# EAGLE schematic fretscanner5000 (EAGLE 6.6.0)
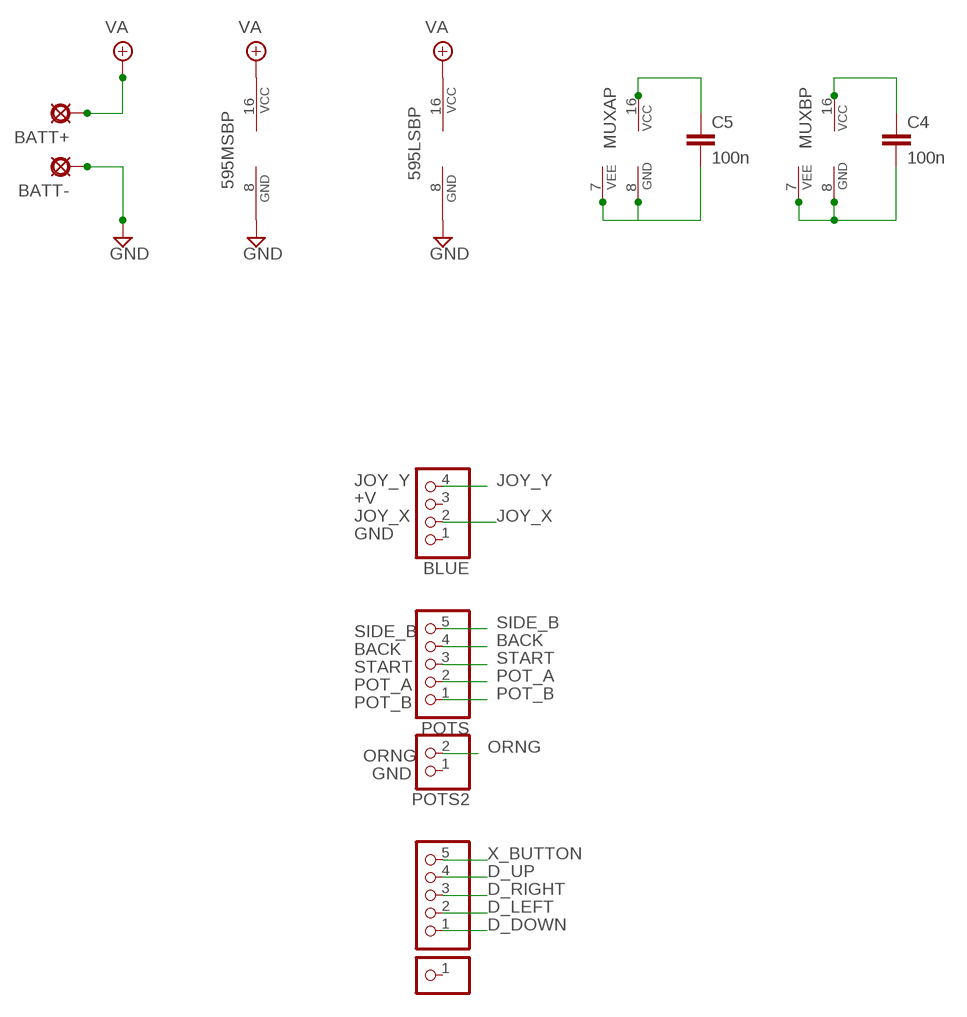
[diagram p0: schematic, sheet 1, part 1 of 2]
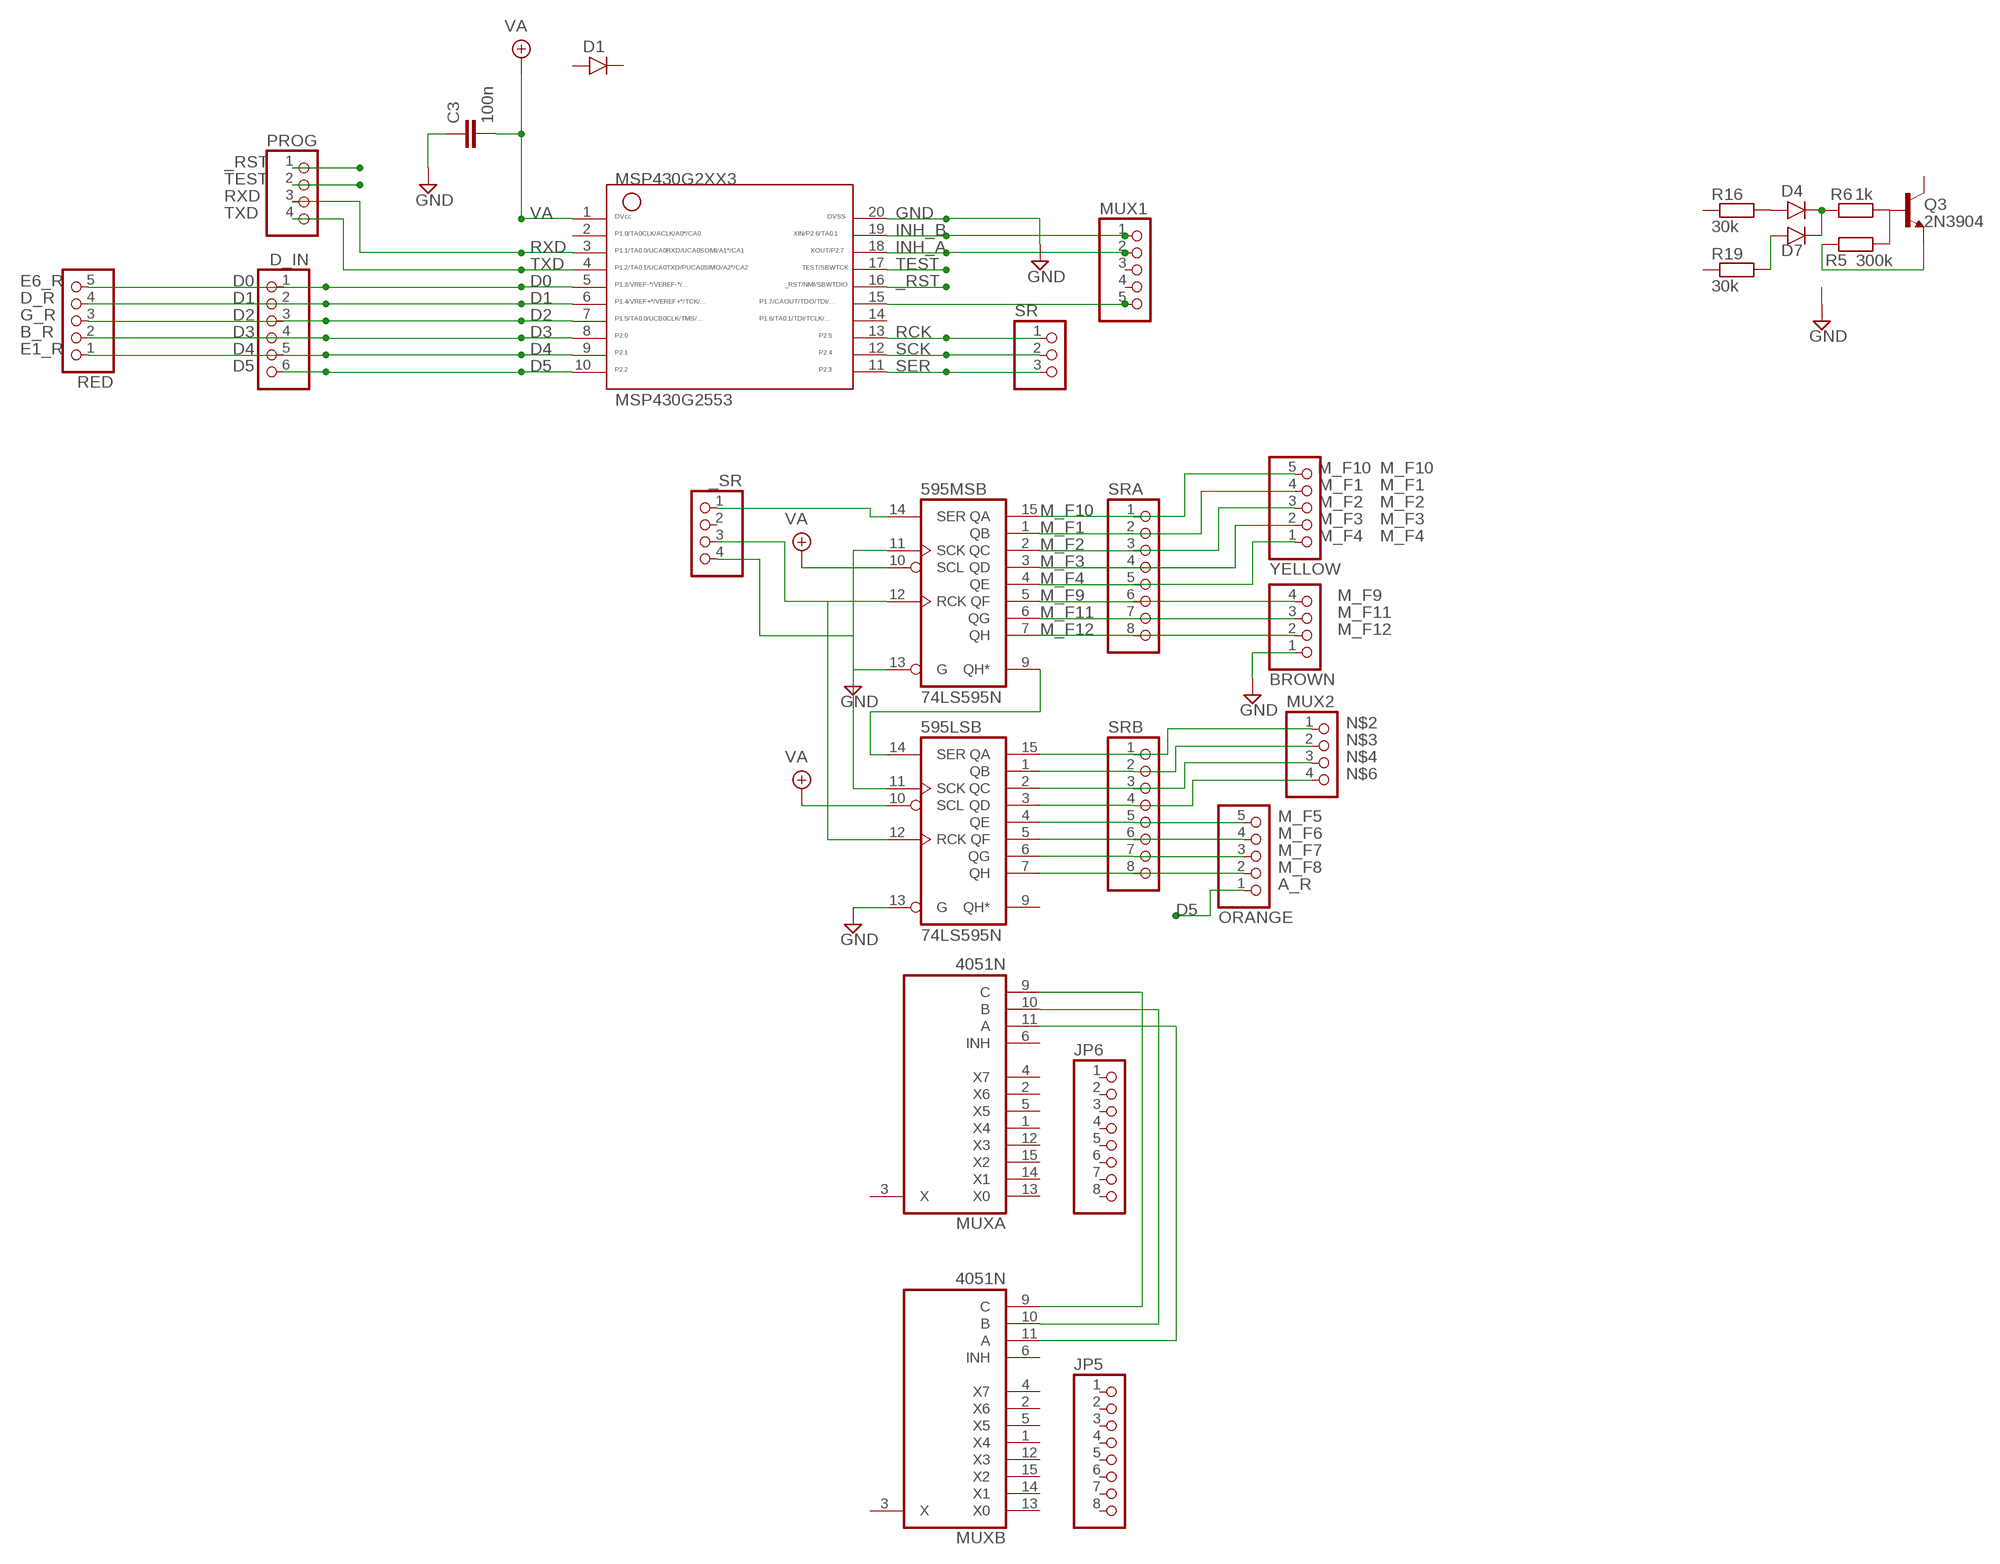
[diagram p1: schematic, sheet 1, part 2 of 2]

## Parts
595LSB  74LS595N  [DIL16]
595MSB  74LS595N  [DIL16]
_SR  PINHD-1X4  [1X04]
BATT+  PADL  [LONG]
BATT-  PADL  [LONG]
BLUE  PINHD-1X4  [1X04]
BROWN  PINHD-1X4  [1X04]
C3  100n  050X030_050  [050X030_050_3]
C4  100n  050X030_050  [050X030_050_3]
C5  100n  050X030_050  [050X030_050_3]
D1  1N400X.4  [DO41-4]
D4  1N4148-2  [DO35-2]
D7  1N4148-2  [DO35-2]
D_IN  PINHD-1X6  [1X06]
DPAD  PINHD-1X5  [1X05]
DPAD2  PINHD-1X1  [1X01]
JP5  PINHD-1X8  [1X08]
JP6  PINHD-1X8  [1X08]
MSP430G2553  G2XX3---N20  [N20]
MUX1  PINHD-1X5  [1X05]
MUX2  PINHD-1X4  [1X04]
MUXA  4051N  [DIL16]
MUXB  4051N  [DIL16]
ORANGE  PINHD-1X5  [1X05]
POTS  PINHD-1X5  [1X05]
POTS2  PINHD-1X2  [1X02]
PROG  PINHD-1X4  [1X04]
Q3  2N3904  [TO92-]
R5  300k  6MM-EU1  [R0207/1V]
R6  1k  6MM-EU  [R0207/3]
R16  30k  6MM-EU  [R0207/3]
R19  30k  6MM-EU  [R0207/3]
RED  PINHD-1X5  [1X05]
SR  PINHD-1X3  [1X03]
SRA  PINHD-1X8  [1X08]
SRB  PINHD-1X8  [1X08]
YELLOW  PINHD-1X5  [1X05]

## Nets
_RST: MSP430G2553.16 PROG.1
BACK: POTS.4
D0: D_IN.1 MSP430G2553.5 RED.5
D1: D_IN.2 MSP430G2553.6 RED.4
D2: D_IN.3 MSP430G2553.7 RED.3
D3: D_IN.4 MSP430G2553.8 RED.2
D4: D_IN.5 MSP430G2553.9 RED.1
D5: D_IN.6 MSP430G2553.10 ORANGE.1
D_DOWN: DPAD.1
D_LEFT: DPAD.2
D_RIGHT: DPAD.3
D_UP: DPAD.4
GND: 595LSB.8(GND) 595LSB.13(G) 595MSB.8(GND) 595MSB.13(G) BATT-.1(PAD) BROWN.1 C3.1 MSP430G2553.20
INH_A: MSP430G2553.18 MUX1.2
INH_B: MSP430G2553.19 MUX1.1
JOY_X: BLUE.2
JOY_Y: BLUE.4
M_F1: 595MSB.1(QB) SRA.2 YELLOW.4
M_F2: 595MSB.2(QC) SRA.3 YELLOW.3
M_F3: 595MSB.3(QD) SRA.4 YELLOW.2
M_F4: 595MSB.4(QE) SRA.5 YELLOW.1
M_F5: 595LSB.4(QE) ORANGE.5 SRB.5
M_F6: 595LSB.5(QF) ORANGE.4 SRB.6
M_F7: 595LSB.6(QG) ORANGE.3 SRB.7
M_F8: 595LSB.7(QH) ORANGE.2 SRB.8
M_F9: 595MSB.5(QF) BROWN.4 SRA.6
M_F10: 595MSB.15(QA) SRA.1 YELLOW.5
M_F11: 595MSB.6(QG) BROWN.3 SRA.7
M_F12: 595MSB.7(QH) BROWN.2 SRA.8
N$1: 595LSB.14(SER) 595MSB.9(QH*)
N$2: 595LSB.15(QA) MUX2.1 SRB.1
N$3: 595LSB.1(QB) MUX2.2 SRB.2
N$4: 595LSB.2(QC) MUX2.3 SRB.3
N$5: Q3.2(B) R5.1 R6.2
N$6: 595LSB.3(QD) MUX2.4 SRB.4
N$7: C5.1 MUXA.16(VCC)
N$8: D4.A R16.2
N$9: C4.1 MUXB.16(VCC)
N$10: D4.C D7.C R6.1
N$11: C4.2 MUXB.7(VEE) MUXB.8(GND)
N$12: C5.2 MUXA.7(VEE) MUXA.8(GND)
N$13: Q3.3(E) R5.2
N$21: D7.A R19.2
N$26: MSP430G2553.15 MUX1.5
N$27: 595MSB.14(SER) _SR.1
N$28: 595LSB.11(SCK) 595MSB.11(SCK) _SR.4
N$29: 595LSB.12(RCK) 595MSB.12(RCK) _SR.3
ORNG: POTS2.2
POT_A: POTS.2
POT_B: POTS.1
RCK: MSP430G2553.13 SR.1
RXD: MSP430G2553.3 PROG.3
SCK: MSP430G2553.12 SR.2
SER: MSP430G2553.11 SR.3
SIDE_B: POTS.5
SR0: MUXA.11(A) MUXB.11(A)
SR1: MUXA.10(B) MUXB.10(B)
SR2: MUXA.9(C) MUXB.9(C)
START: POTS.3
TEST: MSP430G2553.17 PROG.2
TXD: MSP430G2553.4 PROG.4
VA: 595LSB.10(SCL) 595LSB.16(VCC) 595MSB.10(SCL) 595MSB.16(VCC) BATT+.1(PAD) C3.2 MSP430G2553.1
X_BUTTON: DPAD.5
Unconnected: 595LSB.9(QH*) _SR.2 BLUE.1 BLUE.3 D1.A D1.C DPAD2.1 JP5.1 JP5.2 JP5.3 JP5.4 JP5.5 JP5.6 JP5.7 JP5.8 JP6.1 JP6.2 JP6.3 JP6.4 JP6.5 JP6.6 JP6.7 JP6.8 MSP430G2553.2 MSP430G2553.14 MUX1.3 MUX1.4 MUXA.1(X4) MUXA.2(X6) MUXA.3(X) MUXA.4(X7) MUXA.5(X5) MUXA.6(INH) MUXA.12(X3) MUXA.13(X0) MUXA.14(X1) MUXA.15(X2) MUXB.1(X4) MUXB.2(X6) MUXB.3(X) MUXB.4(X7) MUXB.5(X5) MUXB.6(INH) MUXB.12(X3) MUXB.13(X0) MUXB.14(X1) MUXB.15(X2) POTS2.1 Q3.1(C) R16.1 R19.1

## Notes on the sheet
- JOY_Y
- +V
- JOY_X
- GND
- E6_R
- D_R
- SIDE_B
- G_R
- BACK
- B_R
- START
- E1_R
- POT_A
- POT_B
- ORNG
- GND
- M_F10
- M_F1
- M_F2
- M_F3
- M_F4
- A_R

## Library data of the parts
595LSB 595MSB = 74xx-us:74*595: 8-bit SHIFT REGISTER, output latch
_SR BLUE BROWN MUX2 PROG = pinhead:PINHD-1X4: PIN HEADER
BATT+ BATT- = gm-supply:PAD: PAD use this package for pads with any purpose, including input, output, send or return various pad shapes: round, square, octogonal, long, and long offset
C3-C5 = gm-caps-ceramic:050X030_050: 120 - 150pF Xicon Ceramic Disc 5mm lead spacing
D1 = gm-diodes:1N400X: Rectifier Diodes often used in power supply to prevent damage from reverse polarization
D4 D7 = gm-diodes:1N4148: Fast Switching Diode DO-35 glass case a.k.a. 1N914
D_IN = pinhead:PINHD-1X6: PIN HEADER
DPAD MUX1 ORANGE POTS RED YELLOW = pinhead:PINHD-1X5: PIN HEADER
DPAD2 = pinhead:PINHD-1X1: PIN HEADER
JP5 JP6 SRA SRB = pinhead:PINHD-1X8: PIN HEADER
MSP430G2553 = TI_MSP430_v16:G2XX3---N20: MSP430G2XX1 PDIP (N) 20 Pin Package
MUXA MUXB = 40xx:4051: 8-channel ANALOG MULTIPLEXER
POTS2 = pinhead:PINHD-1X2: PIN HEADER
Q3 = gm-trans:2N3904: NPN Transistor
R5 R6 R16 R19 = gm-resistors:6MM-EU: 6mm Resistors (European schematic symbol) Leads spaced 1-6 holes apart for 0.1" perfboard. Suitable for 1/4 watt resistors.
SR = pinhead:PINHD-1X3: PIN HEADER